# Altium project Remote_Controller.PrjPcb
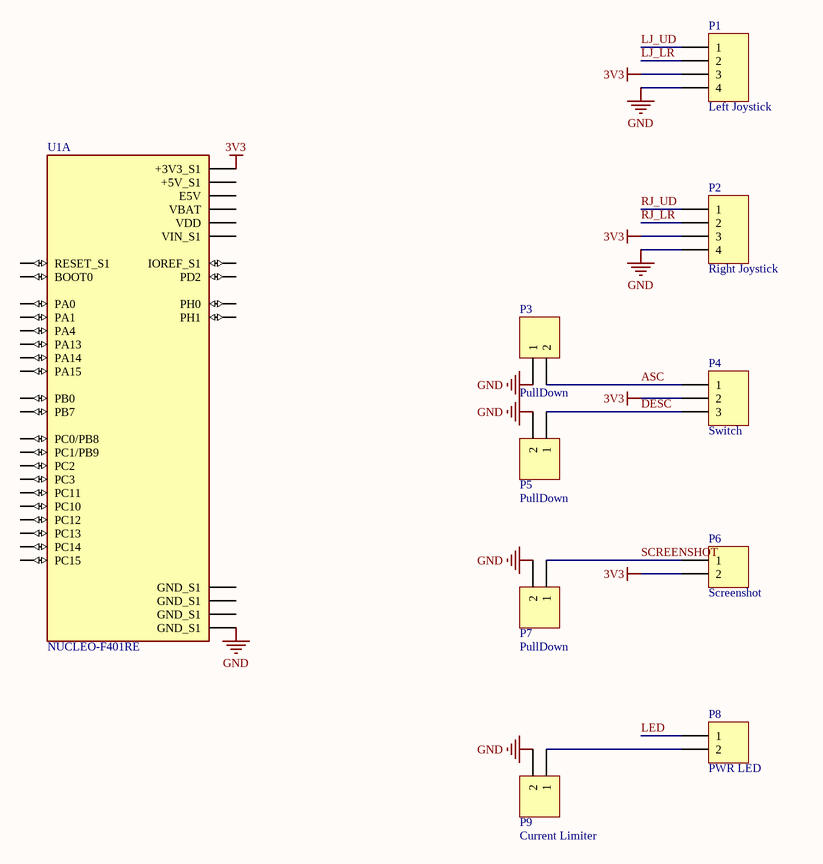
[diagram p0: Remote_Controller.SchDoc]
1 sheet, 10 parts. Net scope: global (net labels, ports and power ports of the same name join across sheets).
Board file: Remote_Controller.PcbDoc

## Sheet Remote_Controller.SchDoc
size A

### Parts
P1  Left Joystick  [HDR1X4]
P2  Right Joystick  [HDR1X4]
P3  PullDown  [HDR1X2]
P4  Switch  [HDR1X3]
P5  PullDown  [HDR1X2]
P6  Screenshot  [HDR1X2]
P7  PullDown  [HDR1X2]
P8  PWR LED  [HDR1X2]
P9  Current Limiter  [HDR1X2]
U1  NUCLEO-F401RE  [ST_NUCLEO-F401RE]  (part A of 6)

### Nets
3V3: P1.3 P2.3 P4.2 P6.2 U1.CN7_16(+3V3_S1)
GND: P1.4 P2.4 P3.1 P5.2 P7.2 P9.2 U1.CN7_22(GND_S1)
ASC: P3.2 P4.1
DESC: P4.3 P5.1
LED: P8.1
LJ_LR: P1.2
LJ_UD: P1.1
RJ_LR: P2.2
RJ_UD: P2.1
SCREENSHOT: P6.1 P7.1
NetP8_2: P8.2 P9.1

Not connected (* = marked no-connect by the designer): U1 CN7_1(PC10) CN7_2(PC11) CN7_3(PC12) CN7_4(PD2) CN7_5(VDD) CN7_6(E5V) CN7_7(BOOT0) CN7_8(GND_S1) CN7_12(IOREF_S1) CN7_13(PA13) CN7_14(RESET_S1) CN7_15(PA14) CN7_17(PA15) CN7_18(+5V_S1) CN7_19(GND_S1) CN7_20(GND_S1) CN7_21(PB7) CN7_23(PC13) CN7_24(VIN_S1) CN7_25(PC14) CN7_27(PC15) CN7_28(PA0) CN7_29(PH0) CN7_30(PA1) CN7_31(PH1) CN7_32(PA4) CN7_33(VBAT) CN7_34(PB0) CN7_35(PC2) CN7_36(PC1/PB9) CN7_37(PC3) CN7_38(PC0/PB8)

### Library data of the parts
P1 P2 = Header 4: Header, 4-Pin; LatestRevisionDate: 17-Jul-2002; LatestRevisionNote: Re-released for DXP Platform.; Publisher: Altium Limited
P3 P5-P9 = Header 2: Header, 2-Pin; LatestRevisionDate: 17-Jul-2002; LatestRevisionNote: Re-released for DXP Platform.; Publisher: Altium Limited
P4 = Header 3: Header, 3-Pin; LatestRevisionDate: 17-Jul-2002; LatestRevisionNote: Re-released for DXP Platform.; Publisher: Altium Limited
U1 = NUCLEO-F401RE: STM32 Nucleo-64 development board with STM32F401RET6 MCU, supports Arduino and ST morpho connectivity; Availability: Unavailable; Price: None; Package: None; MP: NUCLEO-F401RE; Value: *